# Altium schematic sheet IR_Remote.SchDoc
size A4; Revision: 2.0; SheetNumber: 1; SheetTotal: 2
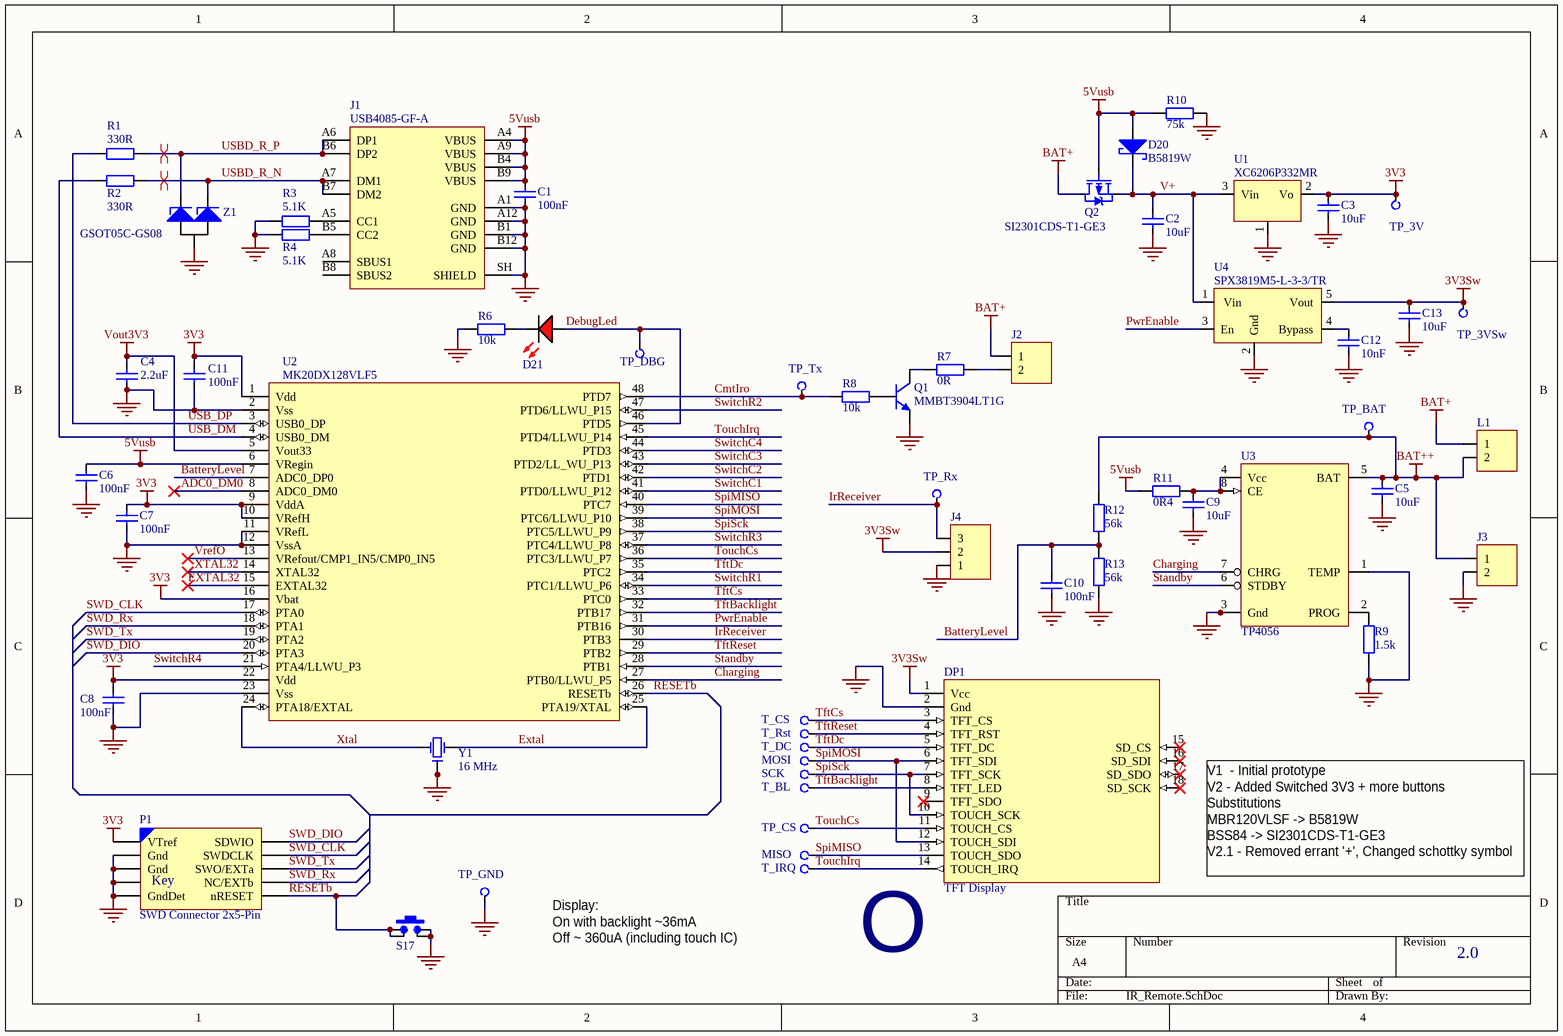
[diagram p0: IR_Remote.SchDoc]

## Parts
C1  100nF  [CCNP1608-0603_N]
C2  10uF  [CCNP2012-0805]
C3  10uF  [CCNP2012-0805]
C4  2.2uF  [CCNP1608-0603_N]
C5  10uF  [CCNP2012-0805]
C6  100nF  [CCNP1608-0603_N]
C7  100nF  [CCNP1608-0603_N]
C8  100nF  [CCNP1608-0603_N]
C9  10uF  [CCNP2012-0805]
C10  100nF  [CCNP1608-0603_N]
C11  100nF  [CCNP1608-0603_N]
C12  10nF  [CCNP1608-0603_N]
C13  10uF  [CCNP2012-0805]
D20  B5819W  [SOD-123]
D21  LED Red  [LED1608-0603-RED_N]  (value not drawn)
DP1  TFT Display  [TFT_320x480 - connector only]
J1  USB4085-GF-A  [USB4085-GF-A]
J2  Connector - JST PH 2-Pin right-angle  [JST-P2B-PH-RA]  (value not drawn)
J3  Connector - JST PH 2-Pin right-angle  [JST-P2B-PH-RA]  (value not drawn)
J4  Connector - JST PH 3-Pin right-angle  [JST-P3B-PH-RA]  (value not drawn)
L1  Header, 2-Pin  [HDR1X2S]  (value not drawn)
Logo1  OSHW Logo  [OSHW]  (value not drawn)  (no BOM)
MISO  TP  [PCBPIN - 0.9mm]  (value not drawn)  (no BOM)
MOSI  TP  [PCBPIN - 0.9mm]  (value not drawn)  (no BOM)
P1  SWD Connector 2x5-Pin  [SWD-2x5-Jig-Header]  (no BOM)
Q1  MMBT3904LT1G  [SOT23_M]
Q2  SI2301CDS-T1-GE3  [SOT23_N]
R1  330R  [CR1608-0603_N]
R2  330R  [CR1608-0603_N]
R3  5.1K  [CR1608-0603_N]
R4  5.1K  [CR1608-0603_N]
R6  10k  [CR1608-0603_N]
R7  0R  [CR1608-0603_N]
R8  10k  [CR1608-0603_N]
R9  1.5k  [CR1608-0603_N]
R10  75k  [CR1608-0603_N]
R11  0R4  [CR2012-0805]
R12  56k  [CR1608-0603_N]
R13  56k  [CR1608-0603_N]
S17  Reset  [SMD-SW-4_5.1x5.1x3.5_M]  (value not drawn)
SCK  TP  [PCBPIN - 0.9mm]  (value not drawn)  (no BOM)
T_BL  TP  [PCBPIN - 0.9mm]  (value not drawn)  (no BOM)
T_CS  TP  [PCBPIN - 0.9mm]  (value not drawn)  (no BOM)
T_DC  TP  [PCBPIN - 0.9mm]  (value not drawn)  (no BOM)
T_IRQ  TP  [PCBPIN - 0.9mm]  (value not drawn)  (no BOM)
T_Rst  TP  [PCBPIN - 0.9mm]  (value not drawn)  (no BOM)
TP_3V  TP  [PCBPIN - 0.9mm]  (value not drawn)  (no BOM)
TP_3VSw  TP  [PCBPIN - 0.9mm]  (value not drawn)  (no BOM)
TP_BAT  TP  [PCBPIN - 0.9mm]  (value not drawn)  (no BOM)
TP_CS  TP  [PCBPIN - 0.9mm]  (value not drawn)  (no BOM)
TP_DBG  TP  [PCBPIN - 0.9mm]  (value not drawn)  (no BOM)
TP_GND  TP  [PCBPIN - 0.9mm]  (value not drawn)  (no BOM)
TP_Rx  TP  [PCBPIN - 0.7mm]  (value not drawn)  (no BOM)
TP_Tx  TP  [PCBPIN - 0.9mm]  (value not drawn)  (no BOM)
U1  XC6206P332MR  [SOT23_M]
U2  MK20DX128VLF5  [TSQFP50P900X900-48M]
U3  TP4056  [ESOP8]
U4  SPX3819M5-L-3-3/TR  [SOT23-5_N]
Y1  16 MHz  [Crystal_SMD_3.2x2.5]
Z1  GSOT05C-GS08  [SOT23_N]

## Nets
3V3: C3.2 C7.2 C8.2 C11.2 P1.1(VTref) TP_3V.1(TP) U1.2(Vo) U2.1(Vdd) U2.9(VddA) U2.10(VRefH) U2.16(Vbat) U2.22(Vdd)
3V3Sw: C13.2 DP1.1(Vcc) J4.2 TP_3VSw.1(TP) U4.5(Vout)
5Vusb: C1.2 C6.2 D20.A J1.A4(VBUS) J1.A9(VBUS) J1.B4(VBUS) J1.B9(VBUS) Q2.1(G) R10.1 R11.2 U2.6(VRegin)
BAT+: J2.1 L1.1 Q2.3(D)
BAT++: C5.2 J3.1 L1.2 R12.2 TP_BAT.1(TP) U3.5(BAT)
GND: C1.1 C2.1 C3.1 C4.1 C5.1 C6.1 C7.1 C8.1 C9.1 C10.1 C11.1 C12.1 C13.1 DP1.2(Gnd) J1.A1(GND) J1.A12(GND) J1.B1(GND) J1.B12(GND) J1.SH(SHIELD) J3.2 J4.1 P1.0(Pins) P1.3(Gnd) P1.5(Gnd) P1.9(GndDet) Q1.2(E) R3.1 R4.2 R6.2 R9.1 R10.2 R13.1 S17.2 S17.2b TP_GND.1(TP) U1.1(Gnd) U2.2(Vss) U2.11(VRefL) U2.12(VssA) U2.23(Vss) U3.0 U3.1(TEMP) U3.3(Gnd) U4.2(Gnd) Y1.2(Gnd) Y1.4(Gnd) Z1.3(K)
Vout3V3: C4.2 U2.5(Vout33)
ADC0_DM0: U2.8(ADC0_DM0)
BatteryLevel: C10.2 R12.1 R13.2 U2.7(ADC0_DP0)
Charging: U2.27(PTB0/LLWU_P5) U3.7(CHRG)
CmtIro: R8.1 TP_Tx.1(TP) U2.48(PTD7)
DebugLed: D21.A TP_DBG.1(TP) U2.46(PTD5)
Extal: U2.25(PTA19/XTAL) Y1.3(OSC2)
EXTAL32: U2.15(EXTAL32)
IrReceiver: J4.3 TP_Rx.1(TP) U2.30(PTB3)
PwrEnable: U2.31(PTB16) U4.3(En)
RESETb: P1.10(nRESET) S17.1 S17.1b U2.26(RESETb)
SpiMISO: DP1.13(TOUCH_SDO) MISO.1(TP) U2.40(PTC7)
SpiMOSI: DP1.6(TFT_SDI) DP1.12(TOUCH_SDI) SCK.1(TP) U2.39(PTC6/LLWU_P10)
SpiSck: DP1.7(TFT_SCK) DP1.10(TOUCH_SCK) MOSI.1(TP) U2.38(PTC5/LLWU_P9)
Standby: U2.28(PTB1) U3.6(STDBY)
SWD_CLK: P1.4(SWDCLK) U2.17(PTA0)
SWD_DIO: P1.2(SDWIO) U2.20(PTA3)
SWD_Rx: P1.8(NC/EXTb) U2.18(PTA1)
SWD_Tx: P1.6(SWO/EXTa) U2.19(PTA2)
SwitchC1: U2.41(PTD0/LLWU_P12)
SwitchC2: U2.42(PTD1)
SwitchC3: U2.43(PTD2/LL_WU_P13)
SwitchC4: U2.44(PTD3)
SwitchR1: U2.34(PTC1/LLWU_P6)
SwitchR2: U2.47(PTD6/LLWU_P15)
SwitchR3: U2.37(PTC4/LLWU_P8)
SwitchR4: U2.21(PTA4/LLWU_P3)
TftBacklight: DP1.8(TFT_LED) T_BL.1(TP) U2.32(PTB17)
TftCs: DP1.3(TFT_CS) T_CS.1(TP) U2.33(PTC0)
TftDc: DP1.5(TFT_DC) T_DC.1(TP) U2.35(PTC2)
TftReset: DP1.4(TFT_RST) T_Rst.1(TP) U2.29(PTB2)
TouchCs: DP1.11(TOUCH_CS) TP_CS.1(TP) U2.36(PTC3/LLWU_P7)
TouchIrq: DP1.14(TOUCH_IRQ) T_IRQ.1(TP) U2.45(PTD4/LLWU_P14)
USB_DM: R2.2 U2.4(USB0_DM)
USB_DP: R1.2 U2.3(USB0_DP)
USBD_R_N: J1.A7(DM1) J1.B7(DM2) R2.1 Z1.2(A2)
USBD_R_P: J1.A6(DP1) J1.B6(DP2) R1.1 Z1.1(A1)
V+: C2.2 D20.K Q2.2(S) U1.3(Vin) U4.1(Vin)
VrefO: U2.13(VRefout/CMP1_IN5/CMP0_IN5)
Xtal: U2.24(PTA18/EXTAL) Y1.1(OSC1)
XTAL32: U2.14(XTAL32)
NetC9_2: C9.2 R11.1 U3.4(Vcc) U3.8(CE)
NetC12_2: C12.2 U4.4(Bypass)
NetD21_K: D21.K R6.1
NetJ1_A5: J1.A5(CC1) R3.2
NetJ1_B5: J1.B5(CC2) R4.1
NetJ2_2: J2.2 R7.2
NetQ1_1: Q1.1(B) R8.2
NetQ1_3: Q1.3(C) R7.1
NetR9_2: R9.2 U3.2(PROG)

Not connected (* = marked no-connect by the designer): DP1 9(TFT_SDO)* 15(SD_CS)* 16(SD_SDI)* 17(SD_SDO)* 18(SD_SCK)*; J1 A8(SBUS1) B8(SBUS2)

## Layout directives
differential pair: USBD_R_N, USBD_R_P

## Notes on the sheet
- (near DP1) V1  - Initial prototype
  V2 - Added Switched 3V3 + more buttons
  Substitutions
  MBR120VLSF -> B5819W
  BSS84 -> SI2301CDS-T1-GE3
  V2.1 - Removed errant '+', Changed schottky symbol
- Display:
  On with backlight ~36mA
  Off ~ 360uA (including touch IC)
- (in symbol OSHW Logo) O
- (in symbol SWD2X5_JIG) Key

## Library data of the parts
C1 C4 C6-C8 C10 C11 = Cap_CCNP_0603: Capacitor non-polar SMT 0603; Manufacturer: Generic Components; Class: Passive; Published: 08/06/2000; Publisher: Altium Hobart Technology Centre; SubClass: Capacitor; Farnell PN: *; Digikey: *
  C1 C6-C8 C10 C11: Value: 100nF; LCSC: C14663
  C4: Value: 2.2uF; LCSC: C23630
C2 C3 C5 C9 C13 = Cap: Capacitor; Manufacturer: Generic Components; Class: Passive; Published: 08/06/2000; Publisher: Altium Hobart Technology Centre; SubClass: Capacitor; Farnell PN: *; Digikey: *; Value: 10uF; LCSC: C15850
C12 = Cap_CCNP_0603_10nF: 50V 10nF X7R ±10% 0603 MLCC; Manufacturer: Generic Components; Class: Passive; SubClass: Capacitor; Published: 08/06/2000; Publisher: Altium Hobart Technology Centre; Farnell PN: *; Digikey: *; LCSC: C57112; Value: 10nF
D20 = B5819W: Diode - Schottky 1A 40V Vrm SOD-123; Manufacturer: Generic Components; Class: Discrete; SubClass: Diode - Switching; Published: 08/06/2000; Publisher: Altium Hobart Technology Centre; Digikey: *; Farnell PN: *; LCSC: C8598
D21 = LED-0603-Red: LED 0603 Red; Manufacturer: Generic Components; Class I: Optoelectronic; Published: 8-Jun-2000; Revision: July-2002: Re-released for DXP Platform.; Publisher: Altium Limited; Class II: LED; Farnell PN: 1581239; Digikey: *; LCSC: C2286
DP1 = TFT_320x480: TFT Display 320x480 with touch (IL9488+XPT2046)
J1 = USB4085-GF-A: USB-C, USB 2.0 Receptacle Connector 16 Position Through Hole, Right Angle; Angle: 90; Part Number: USB4085-GF-A; Digikey Part Number: 2073-USB4085-GF-ACT-ND; Digikey Link: https://www.digikey.ee/product-detail/en/gct/USB4085-GF-A/2073-USB4085-GF-ACT-ND/9859733; Digikey: 2073-USB4085-GF-ACT-ND; Farnell PN: 2924867; LCSC: *
J2 J3 = JST-B2B-PH-B: LatestRevisionDate: 17-Jul-2002; LatestRevisionNote: Re-released for DXP Platform.; Publisher: Altium Limited; LCSC: *
J4 = JST-B3B-PH-B: LatestRevisionDate: 17-Jul-2002; LatestRevisionNote: Re-released for DXP Platform.; Publisher: Altium Limited; LCSC: *; Farnell PN: 1516277; Digikey: 455-2248-ND
L1 = Header 1x2: LatestRevisionDate: 17-Jul-2002; LatestRevisionNote: Re-released for DXP Platform.; Publisher: Altium Limited; LCSC: *
MISO MOSI SCK T_BL T_CS T_DC T_IRQ T_Rst TP_3V TP_3VSw TP_BAT TP_CS TP_DBG TP_GND TP_Rx TP_Tx = TP: Test Point; Digikey: *; Farnell PN: *; LCSC: *
P1 = SWD2X5_JIG: LatestRevisionDate: 17-Jul-2002; LatestRevisionNote: Re-released for DXP Platform.; Publisher: Altium Limited; Farnell PN: 1865285; LCSC: *
Q1 = MMBT3904LT1G: NPN General Purpose Transistor, NPN Silicon, 3-Pin SOT-23, Pb-Free, Tape and Reel; Manufacturer: On Semiconductor; IC Continuous (A): 0.2; fT Min (MHz): 300; ComponentLink2Description: Datasheet; Polarity: NPN; PackageDescription: 3-Pin Small Outline Transistor, Body 2.92 x 1.3 mm, Pitch 0.95 mm; ComponentLink2URL: http://www.onsemi.cn/pub_link/Collateral/MMBT3904LT1-D.PDF; DatasheetVersion: Rev. 12; Mounting Technology: Surface Mount; PartNumber: MMBT3904LT1G; ComponentLink1URL: http://www.onsemi.com/; ComponentLink3Description: Package Specification; ComponentLink1Description: Manufacturer URL; PackageVersion: Rev. AP, 11/2009; PackageReference: SOT-23-3-318-08; Packing: Tape and Reel; ComponentLink3URL: http://www.onsemi.cn/pub_link/Collateral/318-08.PDF; RoHS: TRUE; LCSC: C20526
Q2 = SI2301CDS-T1-GE3: TrenchFET Power MOSFET, P-Channel Enhancement Mode FET 20V RdsOn~.14Ohm; Digikey: *; Farnell PN: *; LCSC: C10487
R1-R4 = Res_CR0603: Resistor SMT 0603; Manufacturer: Generic Components; Class: Passive; Published: 08/06/2000; Publisher: Altium Hobart Technology Centre; SubClass: Resistor; Farnell PN: *; Digikey: *
  R1 R2: Value: 330R; LCSC: C22775
  R3 R4: Value: 5.1K; LCSC: C23186
R6 R8 = Res_CR0603_10k: 100mW SMT ±1% 0603 Chip Resistor; Manufacturer: Generic Components; Class: Passive; Published: 08/06/2000; Publisher: Altium Hobart Technology Centre; SubClass: Resistor; Farnell PN: *; Digikey: *; LCSC: C25804; Value: 10k
R7 = Res_CR0603_0R: 100mW SMT ±1% 0603 Chip Resistor; Manufacturer: Generic Components; Class: Passive; Published: 08/06/2000; Publisher: Altium Hobart Technology Centre; SubClass: Resistor; Farnell PN: *; Digikey: *; LCSC: C21189; Value: 0R
R9 = Res_CR0603_1k5: 100mW SMT ±1% 0603 Chip Resistor; Manufacturer: Generic Components; Class: Passive; Published: 08/06/2000; Publisher: Altium Hobart Technology Centre; SubClass: Resistor; Farnell PN: *; Digikey: *; LCSC: C22843; Value: 1.5k
R10 = Res_CR0603_75k: 100mW SMT ±1% 0603 Chip Resistor; Manufacturer: Generic Components; Class: Passive; Published: 08/06/2000; Publisher: Altium Hobart Technology Centre; SubClass: Resistor; Farnell PN: *; Digikey: *; LCSC: C23242; Value: 75k
R11 = Res_CR0805: Resistor SMT 0805; Manufacturer: Generic Components; Class: Passive; Published: 08/06/2000; Publisher: Altium Hobart Technology Centre; SubClass: Resistor; Farnell PN: *; Digikey: *; LCSC: C25271; Value: 0R4
R12 R13 = Res_CR0603_56k: 100mW SMT ±1% 0603 Chip Resistor; Manufacturer: Generic Components; Class: Passive; Published: 08/06/2000; Publisher: Altium Hobart Technology Centre; SubClass: Resistor; Farnell PN: *; Digikey: *; LCSC: C23206; Value: 56k
S17 = SW_PB-TS: Switch Tactile SPST 5.10mm X 5.10mm / (1.5mm=C318884) / (2.0mm=C318888) / (3.5mm=C318886); Revision: 1.0; LCSC: C318888
U1 = XC6206P332MR: Regulator 3V3 200mA, LDO regulator (Low ESR ceramic caps); Farnell PN: 8796980; LCSC: C5446
U2 = MK20DX128VLF5: Arm Cortex M4
U3 = TP4056: 1A Standalone Linear Li-lon Battery Charger with Thermal Regulation
U4 = SPX3819M5-L-3-3/TR: Regulator 3.3V LDO with enable; LCSC: C9055; Farnell PN: 2889625; Digikey: 1016-1873-1-ND
Y1 = Crystal 16MHz: Crystal SMD 3.2 x 2.5 x 0.7 mm; Manufacturer: Generic Components; Class: Oscillator; SubClass: Crystal Oscillator; Published: 08/06/2000; Publisher: Altium Hobart Technology Centre; Digikey: *; Farnell PN: *; LCSC: C13738
Z1 = GSOT05C-GS08: Two-Line ESD Protection in SOT-23; Digikey: *; Farnell PN: *; LCSC: C1976097